# EAGLE design terminal board (EAGLE 7.3.0)
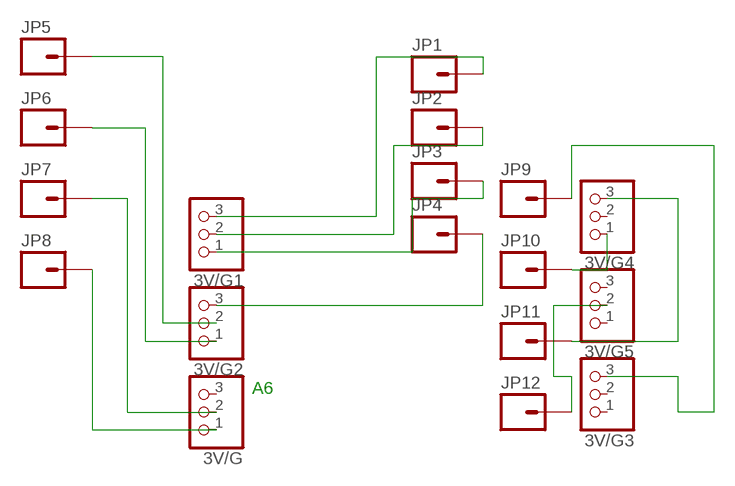
[diagram p0: schematic, sheet 1]

## Parts
3V/G  PINHD-1X3CB  [1X03-CLEANBIG]
3V/G1  PINHD-1X3CB  [1X03-CLEANBIG]
3V/G2  PINHD-1X3CB  [1X03-CLEANBIG]
3V/G3  PINHD-1X3CB  [1X03-CLEANBIG]
3V/G4  PINHD-1X3CB  [1X03-CLEANBIG]
3V/G5  PINHD-1X3CB  [1X03-CLEANBIG]
JP1  M01PTH_2MM  [1X01_2MM]
JP2  M01PTH_2MM  [1X01_2MM]
JP3  M01PTH_2MM  [1X01_2MM]
JP4  M01PTH_2MM  [1X01_2MM]
JP5  M01PTH_2MM  [1X01_2MM]
JP6  M01PTH_2MM  [1X01_2MM]
JP7  M01PTH_2MM  [1X01_2MM]
JP8  M01PTH_2MM  [1X01_2MM]
JP9  M01PTH_2MM  [1X01_2MM]
JP10  M01PTH_2MM  [1X01_2MM]
JP11  M01PTH_2MM  [1X01_2MM]
JP12  M01PTH_2MM  [1X01_2MM]

## Nets
N$1: 3V/G2.2 JP5.1
N$2: 3V/G2.1 JP6.1
N$3: 3V/G.2 JP7.1
N$4: 3V/G.1 JP8.1
N$5: 3V/G1.3 JP1.1
N$6: 3V/G1.2 JP2.1
N$7: 3V/G1.1 JP3.1
N$8: 3V/G2.3 JP4.1
N$9: 3V/G4.1 JP10.1
N$10: 3V/G4.3 JP11.1
N$11: 3V/G5.2 JP12.1
N$12: 3V/G3.3 JP9.1
Unconnected: 3V/G3.1 3V/G3.2 3V/G4.2 3V/G5.1 3V/G5.3 3V/G.3

## Notes on the sheet
- A6

## Library data of the parts
3V/G 3V/G1-3V/G5 = adafruit:PINHD-1X3: PIN HEADER
JP1-JP12 = SparkFun-Connectors:M01: Header 1 Standard 1-pin 0.1" header. Use with straight break away headers (SKU : PRT-00116), right angle break away headers (PRT-00553), swiss pins (PRT-00743), machine pins (PRT-00117), and female headers (PRT-00115).

## Board
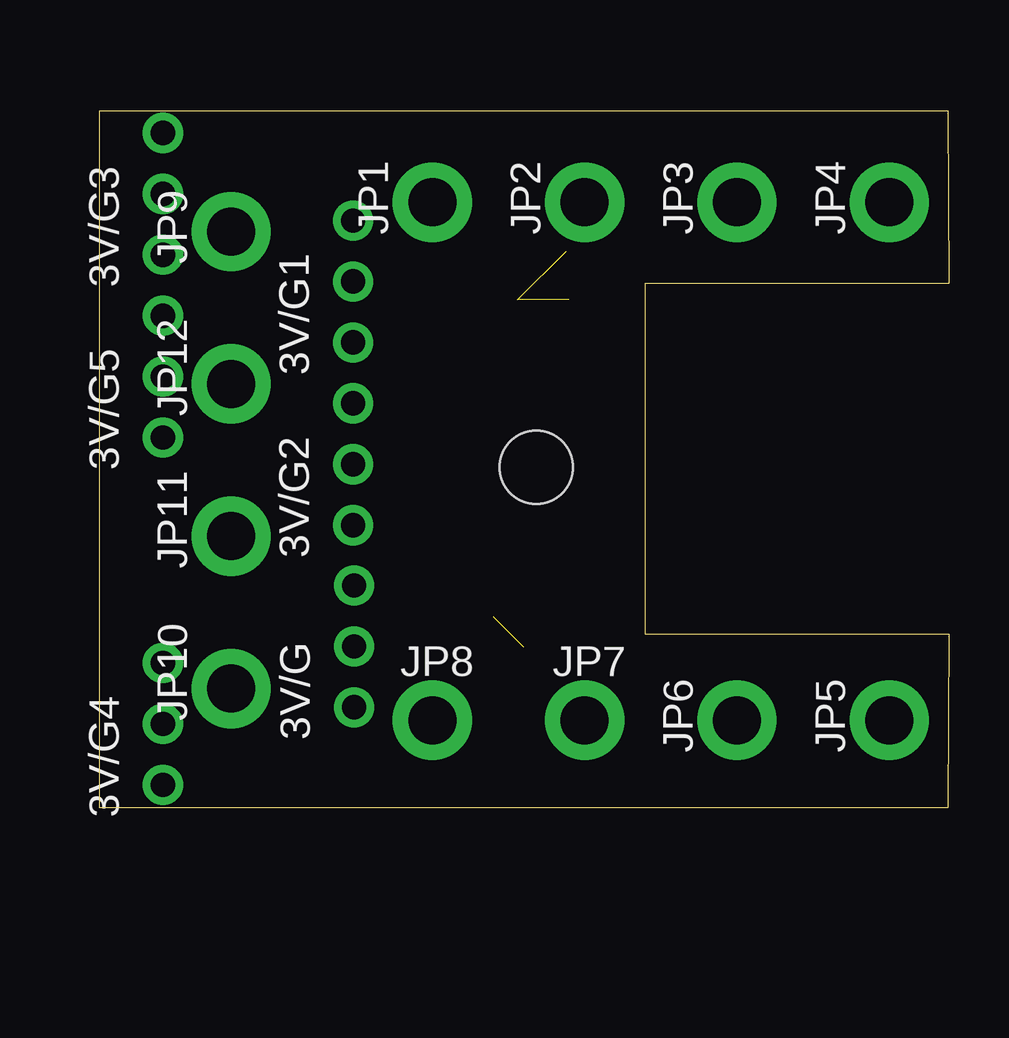
[diagram p1: board, top side]
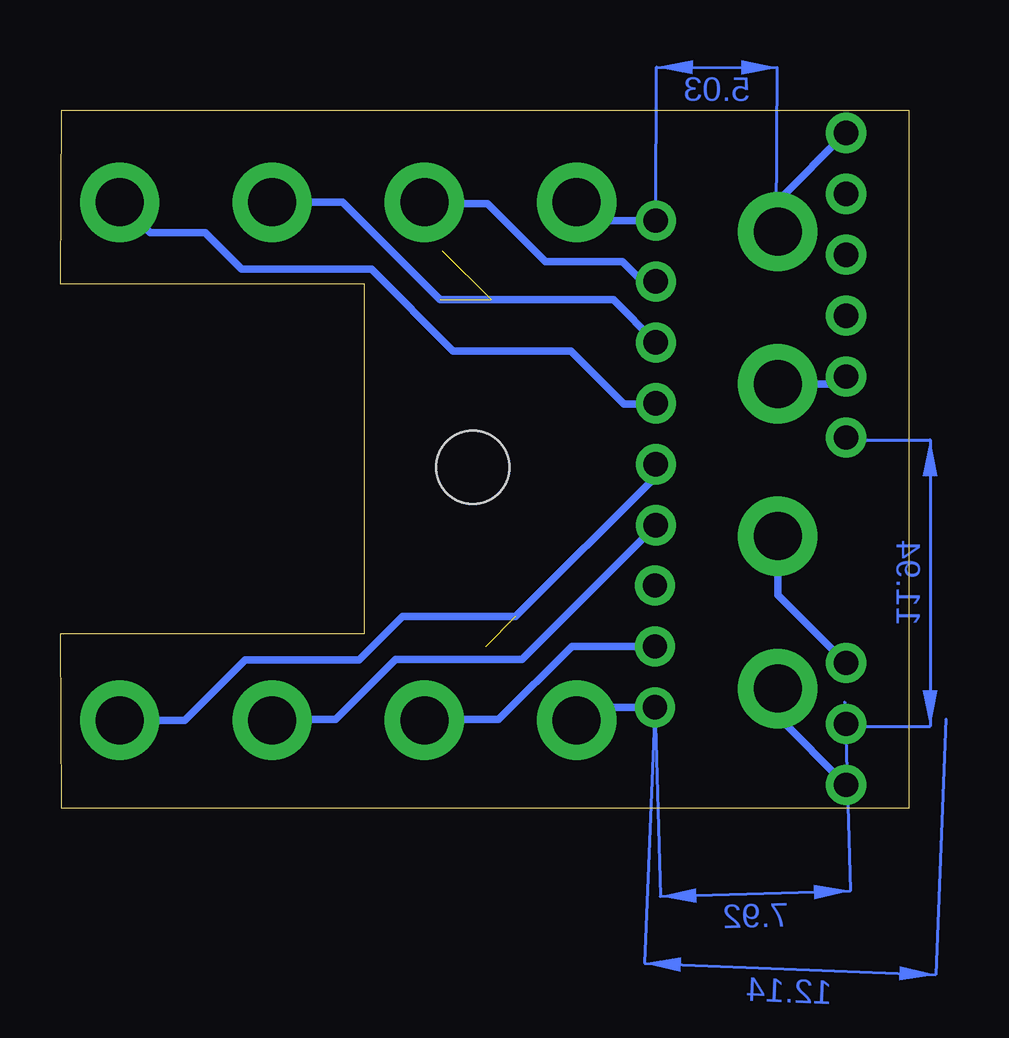
[diagram p2: board, bottom side, seen from below]

Size 35.41 x 29.06 mm. Coordinates in mm from the lower left corner, seen from the top.
Outline: 0,29.06 35.36,29.06 35.41,21.87 22.73,21.87 22.73,7.26 35.41,7.26 35.36,0 0,0 0,29.06
Copper layers (1*16): Top 0.035mm / dielectric 1.5mm / Bottom 0.035mm
Design rules "Othermill-DRC-1-64": minimum track width 8mil, minimum drill 0.8mm, track to track 0.39878125mm, track to pad 0.39878125mm, pad to pad 0.39878125mm, via to via 0.39878125mm, smd to smd 0mil, copper to edge 0mil, drill to drill 1mil, minimum pad ring 10mil, minimum via ring 10mil, stop-mask expansion 1mil, vias tented up to drill 30mil, thermal gap 10mil

### Footprints (pad centres in the part's own frame; a part is rotated, then mirrored left to right if it is on the bottom)
1X03-CLEANBIG = drill 1.016 pad 1.676: 1 -2.54,0; 2 0,0; 3 2.54,0
1X01_2MM = drill 2 pad 3.302: 1 0,0
STAND-OFF-TIGHT = hole 3.048: 0,0

### Placement (x,y rotation side)
3V/G  10.61,6.74 90 top
3V/G1  10.57,21.95 90 top
3V/G2  10.57,14.33 90 top
3V/G3  2.64,25.6 90 top
3V/G4  2.64,3.51 90 top
3V/G5  2.64,17.98 90 top
JP1  13.87,25.25 90 top
JP2  20.22,25.25 90 top
JP3  26.57,25.25 90 top
JP4  32.92,25.25 90 top
JP5  32.92,3.66 90 top
JP6  26.57,3.66 90 top
JP7  20.22,3.66 0 top
JP8  13.87,3.66 0 top
JP9  5.49,24.03 90 top
JP10  5.49,4.98 90 top
JP11  5.49,11.33 90 top
JP12  5.49,17.68 90 top
U$1  [STAND-OFF-TIGHT]  18.19,14.2 0 top

### Tracks (layer width: path | path; a pad name or v marks a point on that pad's centre or on a via)
N$1  (1 unrouted)
  Bottom 0.305: 3V/G2.2 10.57,13.82 16.41,7.98 21.13,7.98 22.94,6.17 27.69,6.17 30.2,3.66 JP5.1
N$2
  Bottom 0.305: 3V/G2.1 16.15,6.2 21.41,6.2 23.93,3.68 26.54,3.68 JP6.1
N$3
  Bottom 0.305: JP7.1 20.19,3.68 17.12,3.68 14.07,6.74 3V/G.2
N$4
  Bottom 0.305: 3V/G.1 13.33,4.2 JP8.1
N$5
  Bottom 0.305: 3V/G1.3 13.11,24.49 JP1.1
N$6
  Bottom 0.305: 3V/G1.2 11.13,21.95 11.96,22.78 15.16,22.78 17.58,25.2 20.17,25.2 JP2.1
N$7  (2 unrouted)
  Bottom 0.305: 3V/G1.1 12.34,21.18 19.56,21.18 23.62,25.25 JP3.1
N$8
  Bottom 0.305: JP4.1 31.65,23.98 29.36,23.98 27.84,22.45 22.43,22.45 19.02,19.05 14.1,19.05 11.89,16.84 10.59,16.84 3V/G2.3
N$9
  Bottom 0.305: JP10.1 5.49,3.81 3V/G4.1
N$10
  Bottom 0.305: JP11.1 5.49,8.89 3V/G4.3
N$11
  Bottom 0.305: JP12.1 2.95,17.68 3V/G5.2
N$12
  Bottom 0.305: JP9.1 5.49,25.3 3V/G3.3
(copper drawn outside any net)
  shapes: Bottom area x4